# EAGLE design Analog_MEMS_Microphone_Breakout_ICS40180 (EAGLE 9.6.2)
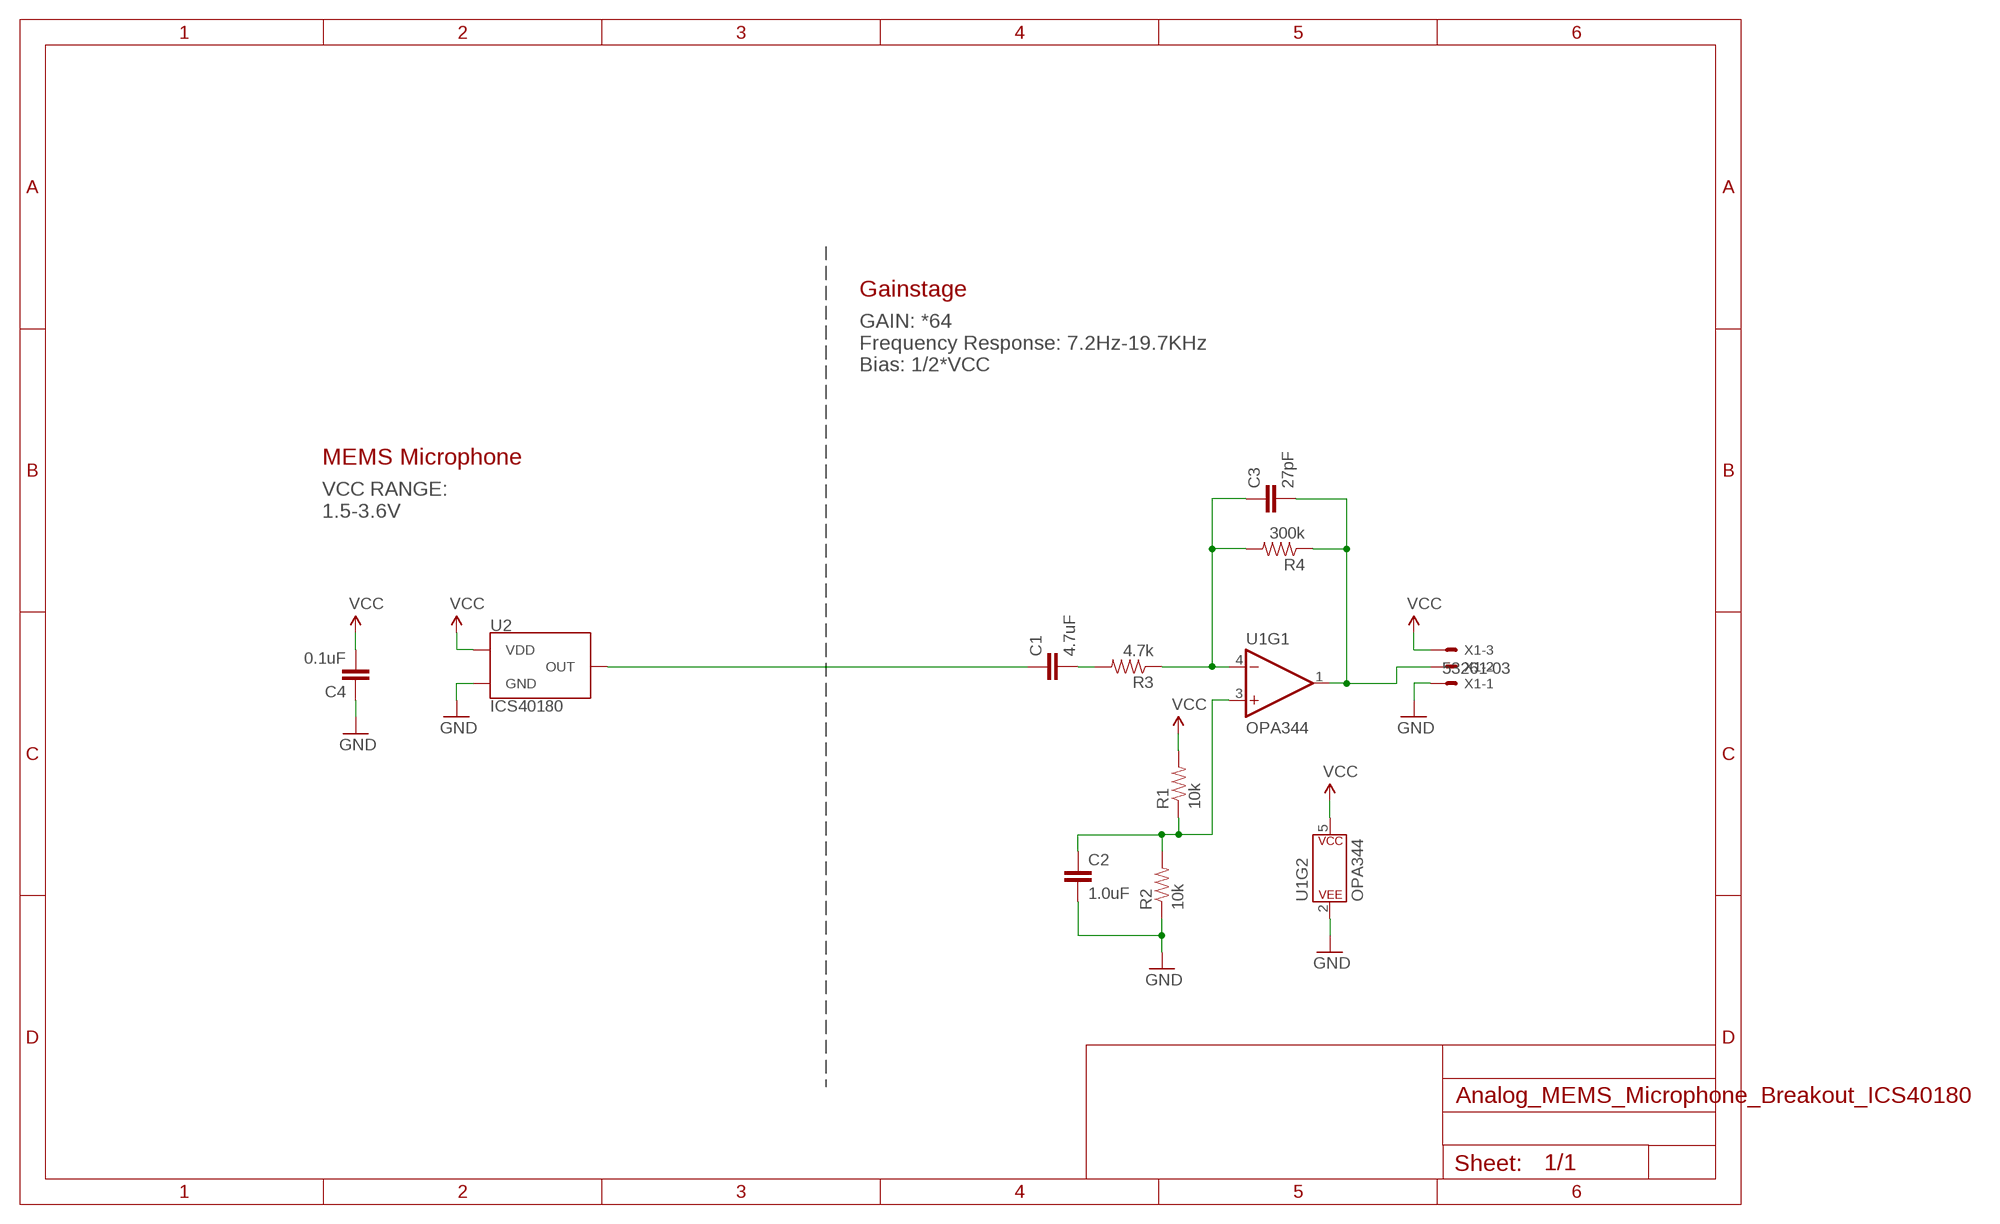
[diagram p0: schematic, sheet 1]

## Parts
C1  4.7uF  4.7UF-0603-6.3V-(10%)  [0603]
C2  1.0uF  1.0UF-0603-16V-10%  [0603]
C3  27pF  27PF-0603-50V-5%  [0603]
C4  0.1uF  0.1UF-0603-25V-(+80/-20%)  [0603]
R1  10k  10KOHM-0603-1/10W-1%  [0603]
R2  10k  10KOHM-0603-1/10W-1%  [0603]
R3  4.7k  4.7KOHM-0603-1/10W-1%  [0603]
R4  300k  300KOHM-0603-1/10W-1%  [0603]
U1  OPA344  [SOT23-5]
U2  ICS40180  [ICS40180]
X1  53261-03  [53261-03]

## Nets
AUD: C3.2 R4.1 U1.1(OUT) X1.2
GND: C2.2 C4.1 R2.1 U1.2(P$V-) U2.2(GND) U2.3(GND) U2.4(GND) X1.1
N$1: C1.1 U2.1(OUT)
N$2: C3.1 R3.1 R4.2 U1.4(-IN)
N$6: C1.2 R3.2
N$7: C2.1 R1.1 R2.2 U1.3(+IN)
VCC: C4.2 R1.2 U1.5(P$V+) U2.5(VDD) X1.3

## Notes on the sheet
- Gainstage
- GAIN: *64
  Frequency Response: 7.2Hz-19.7KHz
  Bias: 1/2*VCC
- MEMS Microphone
- VCC RANGE:
  1.5-3.6V

## Library data of the parts
C1 = SparkFun-Capacitors:4.7UF: 4.7µF ceramic capacitors A capacitor is a passive two-terminal electrical component used to store electrical energy temporarily in an electric field.; PROD_ID: CAP-08280
C2 = SparkFun-Capacitors:1.0UF: 1µF ceramic capacitors A capacitor is a passive two-terminal electrical component used to store electrical energy temporarily in an electric field.; PROD_ID: CAP-00868
C3 = SparkFun-Capacitors:27PF: 27pF ceramic capacitors A capacitor is a passive two-terminal electrical component used to store electrical energy temporarily in an electric field.; PROD_ID: CAP-09989
C4 = SparkFun-Capacitors:0.1UF: 0.1µF ceramic capacitors A capacitor is a passive two-terminal electrical component used to store electrical energy temporarily in an electric field.; PROD_ID: CAP-00810
R1 R2 = SparkFun-Resistors:10KOHM: 10kΩ resistor A resistor is a passive two-terminal electrical component that implements electrical resistance as a circuit element. Resistors act to reduce current flow, and, at the same time, act to lower voltage levels within circuits. - Wikipedia; PROD_ID: RES-00824
R3 = SparkFun-Resistors:4.7KOHM: 4.7kΩ resistor A resistor is a passive two-terminal electrical component that implements electrical resistance as a circuit element. Resistors act to reduce current flow, and, at the same time, act to lower voltage levels within circuits. - Wikipedia; PROD_ID: RES-07857
R4 = SparkFun-Resistors:300KOHM: 300kΩ resistor A resistor is a passive two-terminal electrical component that implements electrical resistance as a circuit element. Resistors act to reduce current flow, and, at the same time, act to lower voltage levels within circuits. - Wikipedia; PROD_ID: RES-10809
U1 = SparkFun-IC-Amplifiers:OPA344: Single gate rail-to-rail output op-amp. Inputs extend 300mV past rails. Datasheet <http://www.ti.com/product/OPA344> SparkFun Products SparkFun Low Current Sensor <https://www.sparkfun.com/products/8883> (SEN-08883) SparkFun Electret Microphone Breakout <https://www.sparkfun.com/products/12758> (BOB-12758); PROD_ID: IC-08251
U2 = ICS-40180:ICS40180: ICS-40180 - RF-Hardened, Low-Noise MEMs Microphone with Bottom Port and Analog Output The ICS-40180* is an analog MEMS microphone with high SNR and enhanced RF immunity. The ICS-40180 includes a MEMS microphone element, an impedance converter, and an output amplifier. Other high-performance specification include a linear response up to 124 dB SPL, tight ±1 dB sensitivity tolerance, and enhanced immunity to both radiated and conducted RF interference. The ICS-40180 is available in a small, 3.5 mm × 2.65 mm × 0.98 mm, surface-mount package. Datasheet <https://invensense.tdk.com/wp-content/uploads/2015/02/DS-000021-v1.22.pdf> SparkFun Products SparkFun MEMS Microphone Breakout - ICS-40180 <https://www.sparkfun.com/products/18011> (BOB-18011) MEMS Microphone - ICS40180 <https://www.sparkfun.com/products/18010> (COM-18010); PROD_ID: IC-15819
X1 = con-molex:53?-03: CONNECTOR wire to board 1.25 mm (.049 inch) pitch header; MF: MOLEX; MPN: 53261-0390; OC_FARNELL: 1125359; OC_NEWARK: 57H5006

## Board
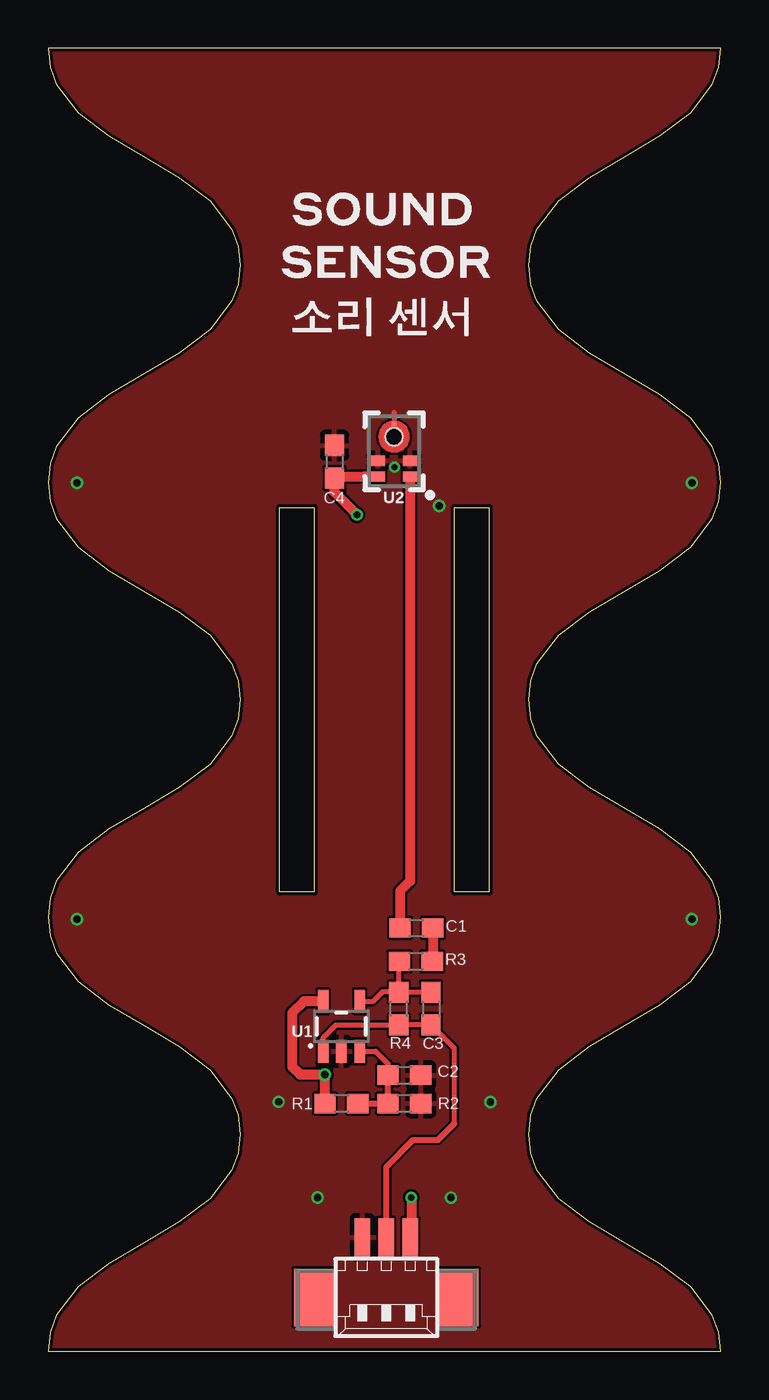
[diagram p1: board, top side]
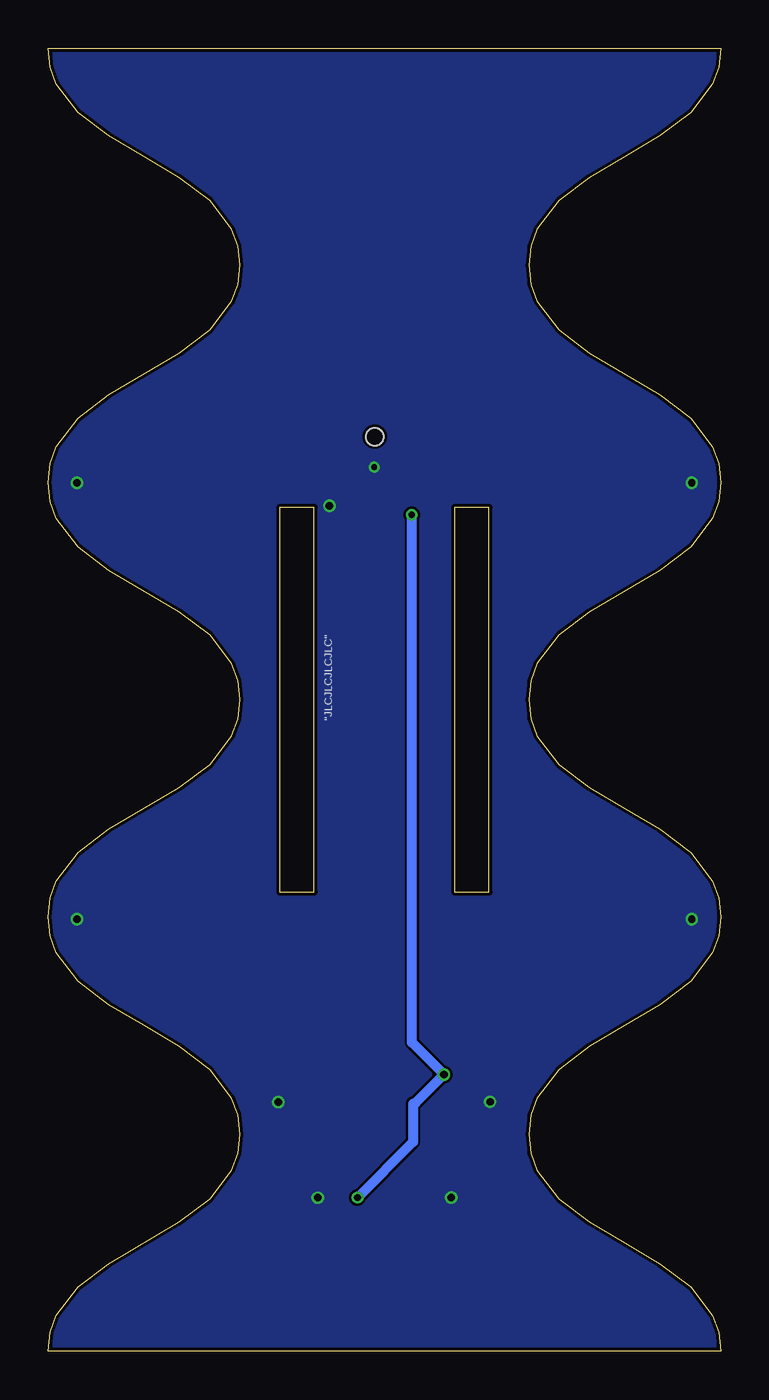
[diagram p2: board, bottom side, seen from below]

Size 35 x 67.8 mm. Coordinates in mm from the lower left corner, seen from the top.
Outline: 35,22.6 35,22.6
Outline: 35,22.6 34.89,23.59 34.57,24.48 33.44,25.95 31.84,27.17 28.17,29.33 26.57,30.54 25.44,32.02 25.12,32.9 25.01,33.9 25.12,34.9 25.44,35.77 26.57,37.25 28.17,38.47 31.84,40.63 33.44,41.84 34.57,43.32 34.89,44.2 35,45.2 34.89,46.19 34.57,47.07 33.44,48.55 31.84,49.77 28.17,51.93 26.57,53.14 25.44,54.62 25.12,55.5 25.01,56.5 25.12,57.49 25.44,58.37 26.57,59.85 28.17,61.07 30,62.15 31.84,63.23 33.44,64.44 34.57,65.92 34.89,66.8 35,67.8 0,67.8 0.11,66.8 0.43,65.92 1.56,64.44 3.16,63.23 5,62.15 6.83,61.07 8.43,59.85 9.56,58.37 9.88,57.49 9.99,56.5 9.88,55.5 9.56,54.62 8.43,53.14 6.83,51.93 3.16,49.77 1.56,48.55 0.43,47.07 0.11,46.19 0,45.2 0.11,44.2 0.43,43.32 1.56,41.84 3.16,40.63 6.83,38.47 8.43,37.25 9.56,35.77 9.88,34.9 9.99,33.9 9.88,32.9 9.56,32.02 8.43,30.54 6.83,29.33 5,28.25 3.16,27.17 1.56,25.95 0.43,24.48 0.11,23.59 0,22.6 0.11,21.6 0.43,20.72 1.56,19.25 3.16,18.03 5,16.95 6.83,15.87 8.43,14.65 9.56,13.18 9.88,12.3 9.99,11.3 9.88,10.3 9.56,9.42 8.43,7.95 6.83,6.73 5,5.65 3.16,4.57 1.56,3.35 0.43,1.88 0.11,1 0,0 35,0 34.89,1 34.57,1.88 33.44,3.35 31.84,4.57 28.17,6.73 26.57,7.95 25.44,9.42 25.12,10.3 25.01,11.3 25.12,12.3 25.44,13.18 26.57,14.65 28.17,15.87 30,16.95 31.84,18.03 33.44,19.25 34.57,20.72 34.89,21.6 35,22.6
Outline: 21.15,23.9 21.15,43.9 22.95,43.9 22.95,23.9 21.15,23.9
Outline: 12.05,43.9 13.85,43.9 13.85,23.9 12.05,23.9 12.05,43.9
Copper layers (1*16): Top 0.035mm / dielectric 1.5mm / Bottom 0.035mm
Design rules "SparkFun-2-Layer-Minimum-JLCPCB": minimum track width 5mil, minimum drill 0.3mm, track to track 5mil, track to pad 5mil, pad to pad 5mil, via to via 5mil, smd to smd 5mil, copper to edge 7mil, drill to drill 7mil, minimum pad ring 5mil, minimum via ring 5mil, stop-mask expansion 2.5mil, vias tented up to drill 25mil, thermal gap 10mil
Holes 0.9 mm at 18,47.58

### Footprints (pad centres in the part's own frame; a part is rotated, then mirrored left to right if it is on the bottom)
0603 = smd 1.1 x 1: 1 -0.85,0; 2 0.85,0
SOT23-5 = smd 0.55 x 1.2: 1 -0.95,-1.3; 2 0,-1.3; 3 0.95,-1.3; 4 0.95,1.3; 5 -0.95,1.3
ICS40180 = smd 0.522 x 0.725: 1 -2.074,-0.838; 2 -1.252,-0.838; 4 -1.252,0.838; 5 -2.074,0.838 | smd 0.25 x 0.25: 3 0.66,-0.01 | hole 0.9: 0,0
53261-03 = smd 0.8 x 2: 1 1.25,-2.5; 2 0,-2.5; 3 -1.25,-2.5 | smd 2.1 x 3: S1 3.75,0.625; S2 -3.75,0.625

### Placement (x,y rotation side)
C1  19.17,22.03 0 top
C2  18.54,14.37 0 top
C3  19.93,17.83 270 top
C4  14.9,46.28 270 top
R1  15.27,12.9 180 top
R2  18.54,12.9 180 top
R3  19.14,20.29 0 top
R4  18.25,17.83 90 top
U1  15.26,16.91 0 top
U2  18,47.58 90 top
X1  17.6,3.43 180 top

### Tracks (layer width: path | path; a pad name or v marks a point on that pad's centre or on a via)
AUD
  Top 0.254: U1.1 14.31,16.31 14.98,16.98 R4.1 C3.2 21.13,15.78 21.13,11.9
  Top 0.305: X1.2 17.6,9.6 19,11 20.3,11 21.13,11.83 21.13,11.9
GND  (via drill 0.3, 0.38)
  Top 0.254: U2.3 18.01,48.86
  other vias: 20.36,43.99 20.96,8 14.02,8.01 12,12.98 18.03,46 23.02,12.97 1.5,22.48 1.5,45.18 33.5,45.18 33.5,22.48
  pour Bottom: 0,0 0,68.58 36.83,68.58 36.83,0
  pour Top: 0,0 0,68.07 35.56,68.07 35.56,0
N$1
  Top 0.254: U2.1
  Top 0.508: U2.1 18.84,24.47 18.32,23.94 C1.1
N$2
  Top 0.254: C3.1 R4.2 | R4.2 18.25,20.26 R3.1 | R4.2 18.22,18.71 17.41,18.71 16.91,18.21 U1.4
N$6
  Top 0.254: R3.2 20.03,20.33
  Top 0.508: C1.2 20.02,20.32 R3.2
N$7
  Top 0.254: U1.3 17.05,15.61 17.69,14.97 C2.1 17.69,14
  Top 0.305: R1.1 R2.2 17.69,14
VCC  (via drill 0.35, 0.39)
  Top 0.254: R1.2 14.35,12.83
  Top 0.508: R1.2 14.4,12.91 v14.4,14.4 13.1,14.4 12.7,14.8 12.7,17.6 13.31,18.21 U1.5 | 16.39,45.51 U2.5 14.97,45.51 C4.2 14.9,44.7 v16.07,43.52 | v18.9,8 18.9,5.98 X1.3
  Bottom 0.508: v16.07,43.52 16.07,16.07 v14.4,14.4 15.9,12.9 16,12.9 16,10.89 v18.89,8 v18.9,8

### Text on the board
bPlace: "JLCJLCJLCJLC"
tValues: Mic Breakout
Measures: Units: INCHES